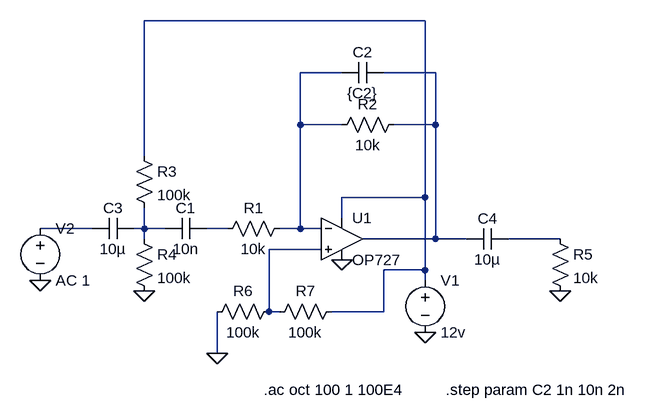
[diagram p0: schematic sim-param.asc]
sim-param.asc, the LTspice schematic file:
Version 4
SHEET 1 880 680
WIRE 528 32 96 32
WIRE 400 112 336 112
WIRE 544 112 464 112
WIRE 336 192 336 112
WIRE 400 192 336 192
WIRE 544 192 544 112
WIRE 544 192 480 192
WIRE 96 240 96 32
WIRE 528 304 528 32
WIRE 528 304 400 304
WIRE 400 336 400 304
WIRE 16 352 -64 352
WIRE 96 352 96 320
WIRE 96 352 80 352
WIRE 128 352 96 352
WIRE 224 352 192 352
WIRE 336 352 336 192
WIRE 336 352 304 352
WIRE 368 352 336 352
WIRE 96 368 96 352
WIRE 544 368 544 192
WIRE 544 368 432 368
WIRE 592 368 544 368
WIRE 736 368 656 368
WIRE 368 384 288 384
WIRE 528 416 528 304
WIRE 528 416 464 416
WIRE 528 432 528 416
WIRE 288 480 288 384
WIRE 304 480 288 480
WIRE 464 480 464 416
WIRE 464 480 384 480
WIRE 208 544 208 480
FLAG -64 432 0
FLAG 96 448 0
FLAG 400 400 0
FLAG 736 448 0
FLAG 528 512 0
FLAG 208 544 0
SYMBOL Opamps/OP727 400 304 R0
SYMATTR InstName U1
SYMBOL res 320 336 R90
WINDOW 0 0 56 VBottom 2
WINDOW 3 32 56 VTop 2
SYMATTR InstName R1
SYMATTR Value 10k
SYMBOL res 496 176 R90
WINDOW 0 0 56 VBottom 2
WINDOW 3 32 56 VTop 2
SYMATTR InstName R2
SYMATTR Value 10k
SYMBOL cap 192 336 R90
WINDOW 0 0 32 VBottom 2
WINDOW 3 32 32 VTop 2
SYMATTR InstName C1
SYMATTR Value 10n
SYMBOL cap 464 96 R90
WINDOW 0 0 32 VBottom 2
WINDOW 3 32 32 VTop 2
SYMATTR InstName C2
SYMATTR Value {C2}
SYMBOL cap 80 336 R90
WINDOW 0 0 32 VBottom 2
WINDOW 3 32 32 VTop 2
SYMATTR InstName C3
SYMATTR Value 10µ
SYMBOL cap 656 352 R90
WINDOW 0 0 32 VBottom 2
WINDOW 3 32 32 VTop 2
SYMATTR InstName C4
SYMATTR Value 10µ
SYMBOL res 80 224 R0
SYMATTR InstName R3
SYMATTR Value 100k
SYMBOL res 80 352 R0
SYMATTR InstName R4
SYMATTR Value 100k
SYMBOL res 720 352 R0
SYMATTR InstName R5
SYMATTR Value 10k
SYMBOL voltage 528 416 R0
SYMATTR InstName V1
SYMATTR Value 12v
SYMBOL voltage -64 336 R0
SYMATTR InstName V2
SYMATTR Value AC 1
SYMBOL res 304 464 R90
WINDOW 0 0 56 VBottom 2
WINDOW 3 32 56 VTop 2
SYMATTR InstName R6
SYMATTR Value 100k
SYMBOL res 400 464 R90
WINDOW 0 0 56 VBottom 2
WINDOW 3 32 56 VTop 2
SYMATTR InstName R7
SYMATTR Value 100k
TEXT 280 600 Left 2 !.ac oct 100 1 100E4
TEXT 560 600 Left 2 !.step param C2 1n 10n 2n

The netlist it stands for:
* sim-param.asc
XU1 N008 N002 N001 0 N003 OP727  ; pins In+ In- V+ V- OUT
R1 N002 N006 10k
R2 N003 N002 10k
C1 N006 N005 10n
C2 N003 N002 {C2}
C3 N005 N004 10µ
C4 N007 N003 10µ
R3 N001 N005 100k
R4 N005 0 100k
R5 N007 0 10k
V1 N001 0 12v
V2 N004 0 AC 1
R6 N008 0 100k
R7 N001 N008 100k
.ac oct 100 1 100E4
.step param C2 1n 10n 2n
.backanno
.end